# Altium project Zigbee_单独小板.PrjPcb
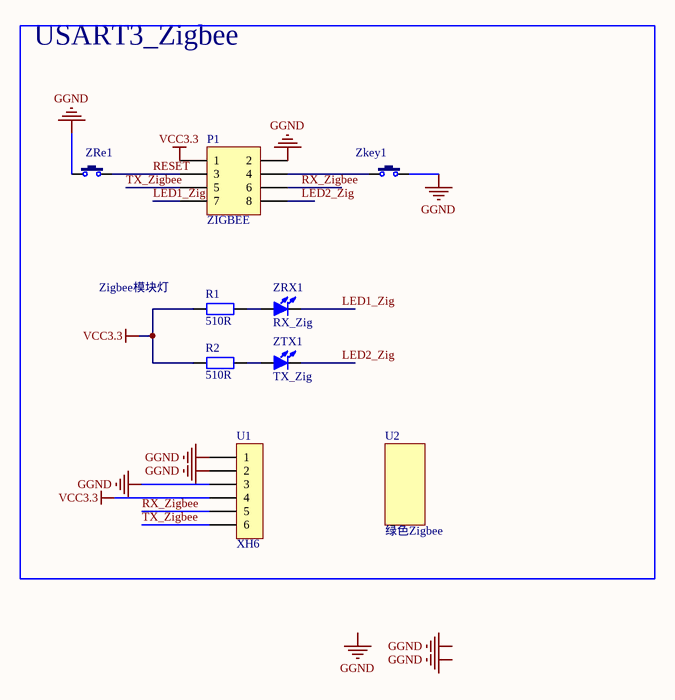
[diagram p0: Sheet.SchDoc]
1 sheet, 9 parts. Net scope: global (net labels, ports and power ports of the same name join across sheets).
Board file: PCB1.PcbDoc

## Sheet Sheet.SchDoc
size A4

### Parts
P1  ZIGBEE  [Zigbee_DTK_DRF1609H-DIP]
R1  510R  [R 0805_M]
R2  510R  [R 0805_M]
U1  XH6  [XH6/2.54mm/180]
U2  绿色Zigbee  [Zigbee_绿色]
Zkey1  ZigReset  [SW DIP-6*6*5]  (value not drawn)
ZRe1  ZigReset  [SW DIP-6*6*5]  (value not drawn)
ZRX1  RX_Zig  [LED 0805R]
ZTX1  TX_Zig  [LED 0805R]

### Nets
GGND: P1.2 U1.1 U1.2 U1.3 Zkey1.2 ZRe1.1
VCC3.3: P1.1 R1.2 R2.2 U1.4
LED1_Zig: P1.7 ZRX1.2(K)
LED2_Zig: P1.8 ZTX1.2(K)
RESET: P1.3 ZRe1.2
RX_Zigbee: P1.6 U1.5
TX_Zigbee: P1.5 U1.6
NetP1_4: P1.4 Zkey1.1
NetR1_1: R1.1 ZRX1.1(A)
NetR2_1: R2.1 ZTX1.1(A)

### Notes on the sheet
- USART3_Zigbee
- Zigbee模块灯
- Labels drawn without touching a wire or pin: GGND

### Library data of the parts
P1 = Header 4X2: Header, 4-Pin, Dual row; LatestRevisionDate: 17-Jul-2002; LatestRevisionNote: Re-released for DXP Platform.; Publisher: Altium Limited
R1 R2 = R: 贴片电阻; 版权归属: 黎明电子style; BOM名称: 贴片电阻; 学习资源: https://lmdzstyle.taobao.com/
Zkey1 ZRe1 = TSW 3x6: 3x6轻触开关; 版权归属: 黎明电子style; BOM名称: 3x6轻触开关; 学习资源: https://lmdzstyle.taobao.com/
ZRX1 ZTX1 = LED-SMD: 贴片LED; 版权归属: 黎明电子style; BOM名称: 贴片LED; 学习资源: https://lmdzstyle.taobao.com/